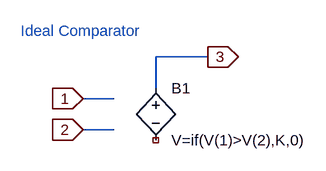
[diagram p0: schematic comparator.asc]
comparator.asc, the LTspice schematic file:
Version 4
SHEET 1 880 680
WIRE 208 80 128 80
WIRE 128 128 128 80
WIRE 64 144 16 144
WIRE 64 192 16 192
FLAG 16 144 1
IOPIN 16 144 In
FLAG 16 192 2
IOPIN 16 192 In
FLAG 208 80 3
IOPIN 208 80 Out
SYMBOL bv 128 112 R0
SYMATTR InstName B1
SYMATTR Value V=if(V(1)>V(2),K,0)
TEXT -80 40 Left 2 ;Ideal Comparator

The netlist it stands for:
* comparator.asc
B1 3 NC_01 V=if(V(1)>V(2),K,0)
* Ideal Comparator
.backanno
.end